# Altium schematic sheet ECU_ADC.SchDoc
size A; SheetNumber: 1; SheetTotal: 3
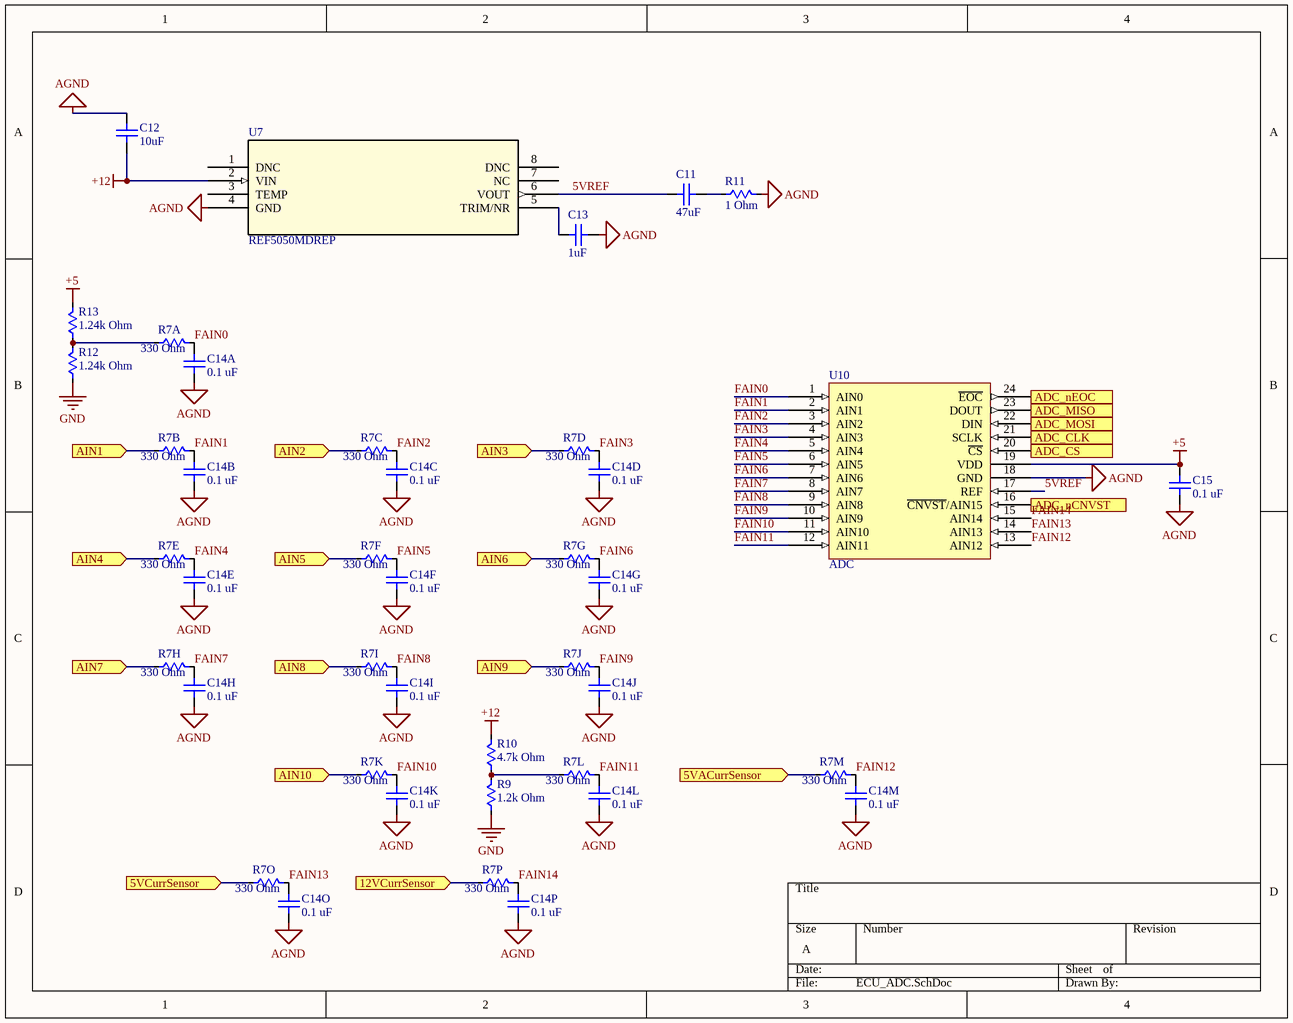
[diagram p0: ECU_ADC.SchDoc]

## Parts
C11  47uF  [0805]
C12  10uF  [0805]
C13  1uF  [0805]
C14A  0.1 uF  [0805]
C14B  0.1 uF  [0805]
C14C  0.1 uF  [0805]
C14D  0.1 uF  [0805]
C14E  0.1 uF  [0805]
C14F  0.1 uF  [0805]
C14G  0.1 uF  [0805]
C14H  0.1 uF  [0805]
C14I  0.1 uF  [0805]
C14J  0.1 uF  [0805]
C14K  0.1 uF  [0805]
C14L  0.1 uF  [0805]
C14M  0.1 uF  [0805]
C14O  0.1 uF  [0805]
C14P  0.1 uF  [0805]
C15  0.1 uF  [0805]
R7A  330 Ohm  [0805]
R7B  330 Ohm  [0805]
R7C  330 Ohm  [0805]
R7D  330 Ohm  [0805]
R7E  330 Ohm  [0805]
R7F  330 Ohm  [0805]
R7G  330 Ohm  [0805]
R7H  330 Ohm  [0805]
R7I  330 Ohm  [0805]
R7J  330 Ohm  [0805]
R7K  330 Ohm  [0805]
R7L  330 Ohm  [0805]
R7M  330 Ohm  [0805]
R7O  330 Ohm  [0805]
R7P  330 Ohm  [0805]
R9  1.2k Ohm  [0805]
R10  4.7k Ohm  [0805]
R11  1 Ohm  [0805]
R12  1.24k Ohm  [0805]
R13  1.24k Ohm  [0805]
U7  REF5050MDREP  [D8]
U10  ADC  [QSOP24]

## Ports
5VACurrSensor (in), 5VCurrSensor (in), 12VCurrSensor (in), ADC_CLK (in), ADC_CS (in), ADC_MISO (out), ADC_MOSI (in), ADC_nCNVST (in), ADC_nEOC (out), AIN1 (in), AIN2 (in), AIN3 (in), AIN4 (in), AIN5 (in), AIN6 (in), AIN7 (in), AIN8 (in), AIN9 (in), AIN10 (in)

## Nets
+5: C15.2 R13.2 U10.19(VDD)
+12: C12.2 R10.2 U7.2(VIN)
AGND: C12.1 C13.2 C14A.1 C14B.1 C14C.1 C14D.1 C14E.1 C14F.1 C14G.1 C14H.1 C14I.1 C14J.1 C14K.1 C14L.1 C14M.1 C14O.1 C14P.1 C15.1 R11.2 U7.4(GND) U10.18(GND)
GND: R9.1 R12.1
5VACurrSensor: R7M.1 ; port 5VACurrSensor
5VCurrSensor: R7O.1 ; port 5VCurrSensor
5VREF: C11.1 U7.6(VOUT) U10.17(REF)
12VCurrSensor: R7P.1 ; port 12VCurrSensor
ADC_CLK: U10.21(SCLK) ; port ADC_CLK
ADC_CS: U10.20(~{CS}) ; port ADC_CS
ADC_MISO: U10.23(DOUT) ; port ADC_MISO
ADC_MOSI: U10.22(DIN) ; port ADC_MOSI
ADC_nCNVST: U10.16(~{CNVST}/AIN15) ; port ADC_nCNVST
ADC_nEOC: U10.24(~{EOC}) ; port ADC_nEOC
AIN1: R7B.1 ; port AIN1
AIN2: R7C.1 ; port AIN2
AIN3: R7D.1 ; port AIN3
AIN4: R7E.1 ; port AIN4
AIN5: R7F.1 ; port AIN5
AIN6: R7G.1 ; port AIN6
AIN7: R7H.1 ; port AIN7
AIN8: R7I.1 ; port AIN8
AIN9: R7J.1 ; port AIN9
AIN10: R7K.1 ; port AIN10
FAIN0: C14A.2 R7A.2 U10.1(AIN0)
FAIN1: C14B.2 R7B.2 U10.2(AIN1)
FAIN2: C14C.2 R7C.2 U10.3(AIN2)
FAIN3: C14D.2 R7D.2 U10.4(AIN3)
FAIN4: C14E.2 R7E.2 U10.5(AIN4)
FAIN5: C14F.2 R7F.2 U10.6(AIN5)
FAIN6: C14G.2 R7G.2 U10.7(AIN6)
FAIN7: C14H.2 R7H.2 U10.8(AIN7)
FAIN8: C14I.2 R7I.2 U10.9(AIN8)
FAIN9: C14J.2 R7J.2 U10.10(AIN9)
FAIN10: C14K.2 R7K.2 U10.11(AIN10)
FAIN11: C14L.2 R7L.2 U10.12(AIN11)
FAIN12: C14M.2 R7M.2 U10.13(AIN12)
FAIN13: C14O.2 R7O.2 U10.14(AIN13)
FAIN14: C14P.2 R7P.2 U10.15(AIN14)
NetC11_2: C11.2 R11.1
NetC13_1: C13.1 U7.5(TRIM/NR)
NetR7A_1: R7A.1 R12.2 R13.1
NetR7L_1: R7L.1 R9.2 R10.1

Not connected (* = marked no-connect by the designer): U7 1(DNC) 3(TEMP) 7(NC) 8(DNC)

## Library data of the parts
C11 = Cap_0805: Samsung Microelectronics CL21A476MQYNNNE
C12 C14A C14B C14C C14D C14E C14F C14G C14H C14I C14J C14K C14L C14M C14O C14P C15 = Cap_0805: Cap 0805
C13 = Cap_0805: 1uF Cap
R7A R7B R7C R7D R7E R7F R7G R7H R7I R7J R7K R7L R7M R7O R7P R9-R13 = Res_0805: Res 0805
U7 = REF5050MDREP: No Description Available; Mfr_Name: Texas Instruments; Copyright: Copyright (C) 2022 Ultra Librarian. All rights reserved.; Manufacturer_Part_Number: REF5050MDREP; RefDes: RefDes; Type: DEV
U10 = MAX11624EEG+-ND: GLOVE, POLYAMIDE, L/FREE, PU, SIZE 6 - More Details